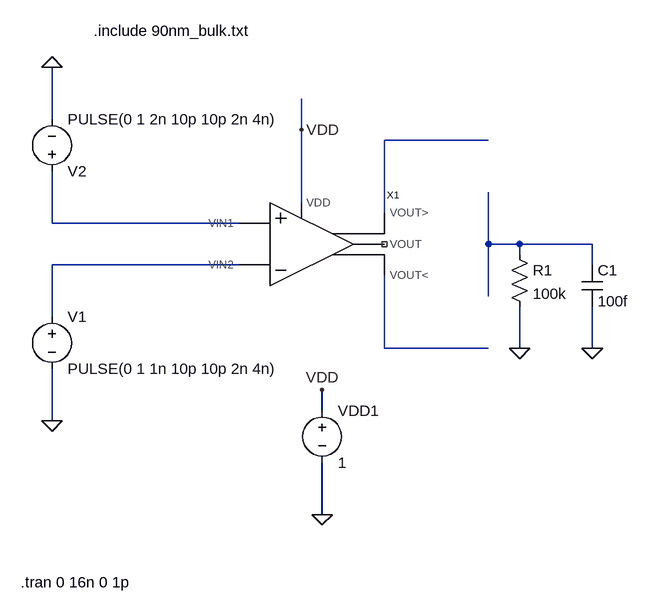
[diagram p0: schematic Comparator_tb.asc]
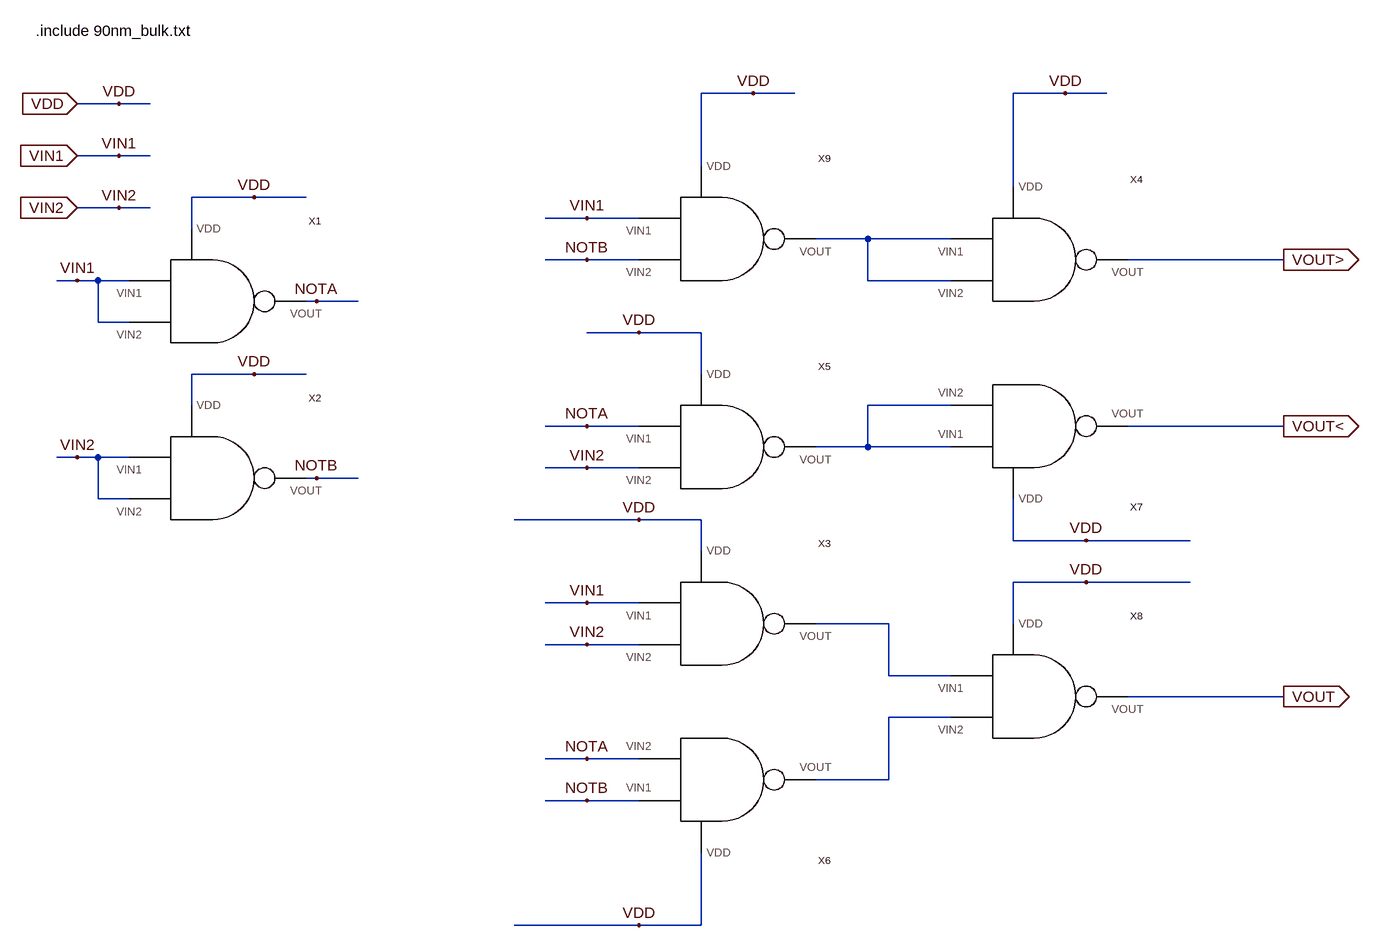
[diagram p1: sub-circuit comparator.asc]
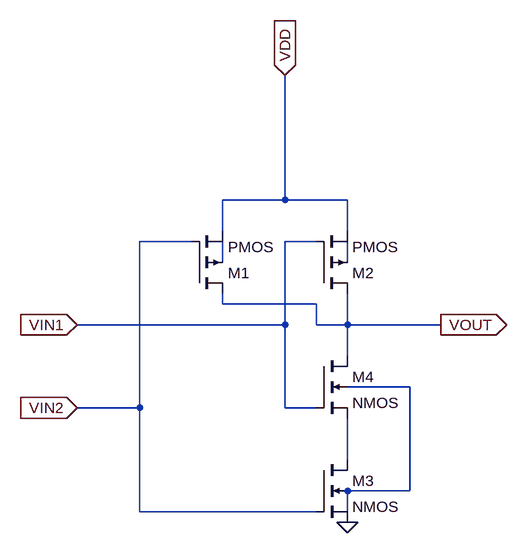
[diagram p2: sub-circuit nand.asc]
Comparator_tb.asc, the LTspice schematic file:
Version 4
SHEET 1 880 680
WIRE -176 -144 -176 -224
WIRE 208 -128 208 -176
WIRE 496 -112 336 -112
WIRE 208 -16 208 -128
WIRE 336 0 336 -112
WIRE -176 16 -176 -64
WIRE 112 16 -176 16
WIRE 496 48 496 -32
WIRE 544 48 496 48
WIRE 656 48 544 48
WIRE 544 64 544 48
WIRE 112 80 -176 80
WIRE 656 80 656 48
WIRE 496 128 496 48
WIRE -176 160 -176 80
WIRE 336 208 336 96
WIRE 496 208 336 208
WIRE 544 208 544 144
WIRE 656 208 656 144
WIRE 240 304 240 272
WIRE -176 320 -176 240
WIRE 240 464 240 384
FLAG 240 464 0
FLAG 240 272 VDD
FLAG 544 208 0
FLAG 656 208 0
FLAG 208 -128 VDD
FLAG -176 320 0
FLAG -176 -224 0
SYMBOL voltage -176 144 R0
WINDOW 123 0 0 Left 0
WINDOW 39 0 0 Left 0
SYMATTR InstName V1
SYMATTR Value PULSE(0 1 1n 10p 10p 2n 4n)
SYMBOL res 528 48 R0
SYMATTR InstName R1
SYMATTR Value 100k
SYMBOL cap 640 80 R0
SYMATTR InstName C1
SYMATTR Value 100f
SYMBOL voltage 240 288 R0
WINDOW 123 0 0 Left 0
WINDOW 39 0 0 Left 0
SYMATTR InstName VDD1
SYMATTR Value 1
SYMBOL voltage -176 -48 M180
WINDOW 123 0 0 Left 0
WINDOW 39 0 0 Left 0
SYMATTR InstName V2
SYMATTR Value PULSE(0 1 2n 10p 10p 2n 4n)
SYMBOL Comparator 208 48 R0
SYMATTR InstName X1
TEXT -112 -280 Left 2 !.include 90nm_bulk.txt
TEXT -224 568 Left 2 !.tran 0 16n 0 1p

comparator.asc, the sub-circuit schematic file:
Version 4
SHEET 1 1184 892
WIRE 224 -432 144 -432
WIRE 288 -432 224 -432
WIRE 704 -432 624 -432
WIRE 768 -432 704 -432
WIRE -752 -416 -816 -416
WIRE -704 -416 -752 -416
WIRE -752 -336 -816 -336
WIRE -704 -336 -752 -336
WIRE 144 -320 144 -432
WIRE 624 -288 624 -432
WIRE -544 -272 -640 -272
WIRE -464 -272 -544 -272
WIRE -752 -256 -816 -256
WIRE -704 -256 -752 -256
WIRE -32 -240 -96 -240
WIRE 48 -240 -32 -240
WIRE -640 -224 -640 -272
WIRE 400 -208 320 -208
WIRE 528 -208 400 -208
WIRE -32 -176 -96 -176
WIRE 48 -176 -32 -176
WIRE 1040 -176 800 -176
WIRE -816 -144 -848 -144
WIRE -784 -144 -816 -144
WIRE -736 -144 -784 -144
WIRE 400 -144 400 -208
WIRE 528 -144 400 -144
WIRE -448 -112 -464 -112
WIRE -384 -112 -448 -112
WIRE -784 -80 -784 -144
WIRE -736 -80 -784 -80
WIRE 48 -64 -32 -64
WIRE 144 -64 48 -64
WIRE -544 0 -640 0
WIRE -464 0 -544 0
WIRE 144 0 144 -64
WIRE -640 48 -640 0
WIRE 528 48 400 48
WIRE -32 80 -96 80
WIRE 48 80 -32 80
WIRE 1040 80 800 80
WIRE 400 112 400 48
WIRE 400 112 320 112
WIRE 528 112 400 112
WIRE -816 128 -848 128
WIRE -784 128 -816 128
WIRE -736 128 -784 128
WIRE -32 144 -96 144
WIRE 48 144 -32 144
WIRE -448 160 -464 160
WIRE -384 160 -448 160
WIRE -784 192 -784 128
WIRE -736 192 -784 192
WIRE 48 224 -144 224
WIRE 144 224 48 224
WIRE 624 256 624 192
WIRE 736 256 624 256
WIRE 896 256 736 256
WIRE 144 272 144 224
WIRE 736 320 624 320
WIRE 896 320 736 320
WIRE -32 352 -96 352
WIRE 48 352 -32 352
WIRE 432 384 320 384
WIRE 624 384 624 320
WIRE -32 416 -96 416
WIRE 48 416 -32 416
WIRE 432 464 432 384
WIRE 528 464 432 464
WIRE 1040 496 800 496
WIRE 528 528 432 528
WIRE -32 592 -96 592
WIRE 48 592 -32 592
WIRE 432 624 432 528
WIRE 432 624 320 624
WIRE -32 656 -96 656
WIRE 48 656 -32 656
WIRE 48 848 -144 848
WIRE 144 848 144 736
WIRE 144 848 48 848
FLAG -816 -336 VIN1
IOPIN -816 -336 In
FLAG -816 -256 VIN2
IOPIN -816 -256 In
FLAG 1040 496 VOUT
IOPIN 1040 496 Out
FLAG 1040 -176 VOUT>
IOPIN 1040 -176 Out
FLAG 1040 80 VOUT<
IOPIN 1040 80 Out
FLAG -752 -336 VIN1
FLAG -752 -256 VIN2
FLAG -816 -144 VIN1
FLAG -448 -112 NOTA
FLAG -816 128 VIN2
FLAG -448 160 NOTB
FLAG -32 -240 VIN1
FLAG -32 -176 NOTB
FLAG -32 80 NOTA
FLAG -32 144 VIN2
FLAG -32 352 VIN1
FLAG -32 416 VIN2
FLAG -32 592 NOTA
FLAG -32 656 NOTB
FLAG -816 -416 VDD
IOPIN -816 -416 In
FLAG -752 -416 VDD
FLAG -544 -272 VDD
FLAG -544 0 VDD
FLAG 48 -64 VDD
FLAG 224 -432 VDD
FLAG 704 -432 VDD
FLAG 48 224 VDD
FLAG 736 256 VDD
FLAG 736 320 VDD
FLAG 48 848 VDD
SYMBOL NAND -624 -112 R0
SYMATTR InstName X1
SYMBOL NAND -624 160 R0
SYMATTR InstName X2
SYMBOL NAND 160 384 R0
SYMATTR InstName X3
SYMBOL NAND 640 -176 R0
SYMATTR InstName X4
SYMBOL NAND 160 112 R0
SYMATTR InstName X5
SYMBOL NAND 160 624 M180
SYMATTR InstName X6
SYMBOL NAND 640 80 M180
SYMATTR InstName X7
SYMBOL NAND 640 496 R0
SYMATTR InstName X8
SYMBOL NAND 160 -208 R0
SYMATTR InstName X9
TEXT -880 -528 Left 2 !.include 90nm_bulk.txt

nand.asc, the sub-circuit schematic file:
Version 4
SHEET 1 880 680
WIRE 32 -64 32 -256
WIRE 32 -64 -64 -64
WIRE 128 -64 32 -64
WIRE -64 -16 -64 -64
WIRE 128 -16 128 -64
WIRE -112 0 -192 0
WIRE 80 0 32 0
WIRE -64 32 -64 0
WIRE 128 32 128 0
WIRE -64 96 -64 80
WIRE 80 96 -64 96
WIRE 32 128 32 0
WIRE 32 128 -288 128
WIRE 80 128 80 96
WIRE 128 128 128 80
WIRE 128 128 80 128
WIRE 272 128 128 128
WIRE 128 176 128 128
WIRE 224 224 128 224
WIRE -192 256 -192 0
WIRE -192 256 -288 256
WIRE 32 256 32 128
WIRE 80 256 32 256
WIRE 128 336 128 272
WIRE 224 384 224 224
WIRE 224 384 128 384
WIRE -192 416 -192 256
WIRE 80 416 -192 416
WIRE 128 416 128 384
FLAG 128 432 0
FLAG -288 128 VIN1
IOPIN -288 128 In
FLAG -288 256 VIN2
IOPIN -288 256 In
FLAG 32 -256 VDD
IOPIN 32 -256 In
FLAG 272 128 VOUT
IOPIN 272 128 Out
SYMBOL pmos4 -112 80 M180
SYMATTR InstName M1
SYMATTR Value2 l=90n w=400n
SYMBOL pmos4 80 80 M180
SYMATTR InstName M2
SYMATTR Value2 l=90n w=400n
SYMBOL nmos4 80 336 R0
SYMATTR InstName M3
SYMATTR Value2 l=90n w=200n
SYMBOL nmos4 80 176 R0
SYMATTR InstName M4
SYMATTR Value2 l=90n w=200n

The netlist it stands for:
* Comparator_tb.asc
V1 N004 0 PULSE(0 1 1n 10p 10p 2n 4n)
R1 N003 0 100k
C1 N003 0 100f
VDD1 VDD 0 1
V2 N002 0 PULSE(0 1 2n 10p 10p 2n 4n)
XX1 N002 N004 NC_01 VDD N001 N005 comparator

* block symbol definitions
.subckt comparator VIN1 VIN2 VOUT VDD VOUT> VOUT<
XX1 VDD VIN1 NOTA VIN1 nand
XX2 VDD VIN2 NOTB VIN2 nand
XX3 VDD VIN1 N003 VIN2 nand
XX4 VDD N001 VOUT> N001 nand
XX5 VDD NOTA N002 VIN2 nand
XX6 VDD NOTB N004 NOTA nand
XX7 VDD N002 VOUT< N002 nand
XX8 VDD N003 VOUT N004 nand
XX9 VDD VIN1 N001 NOTB nand
.include 90nm_bulk.txt
.ends comparator

.subckt nand VDD VIN1 VOUT VIN2
M1 VOUT VIN2 VDD N001 PMOS l=90n w=400n
M2 VOUT VIN1 VDD N002 PMOS l=90n w=400n
M3 N004 VIN2 0 N003 NMOS l=90n w=200n
M4 VOUT VIN1 N004 N003 NMOS l=90n w=200n
.ends nand

.model NMOS NMOS
.model PMOS PMOS
.lib standard.mos
.include 90nm_bulk.txt
.tran 0 16n 0 1p
.backanno
.end